# EAGLE design mainboard (EAGLE 7.6.0)
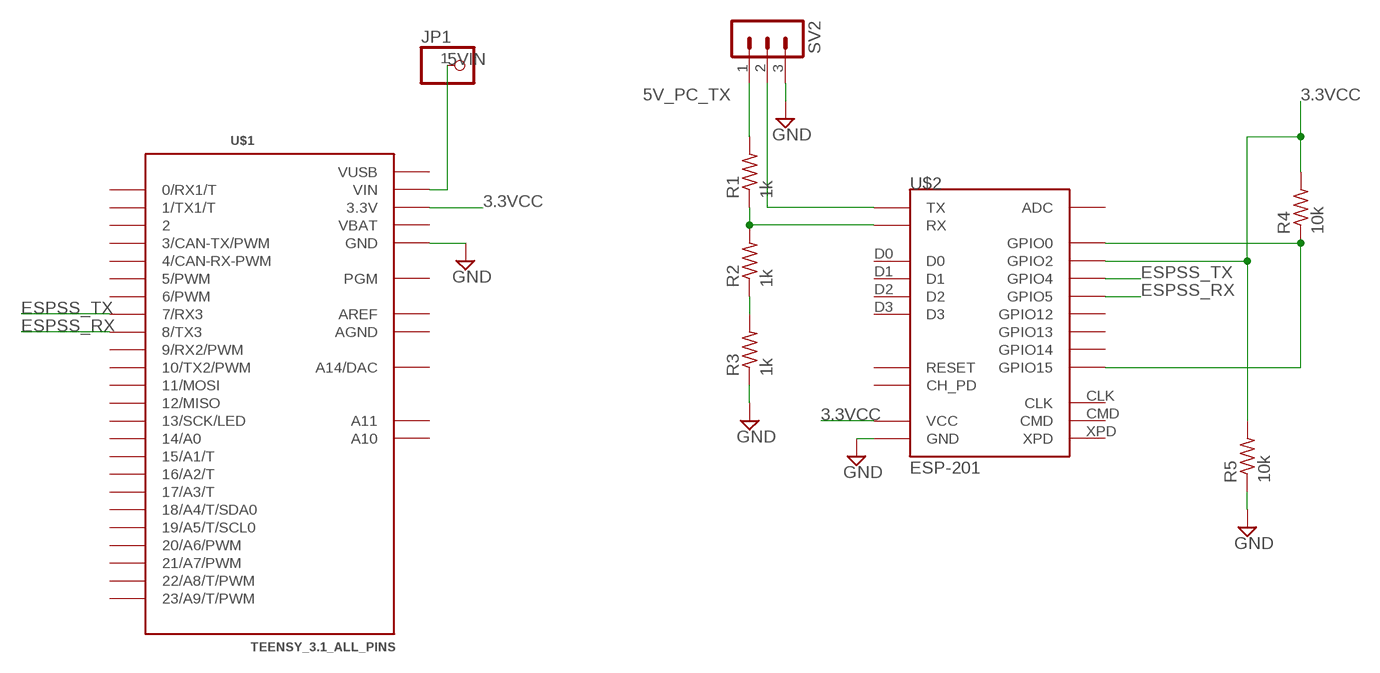
[diagram p0: schematic, sheet 1]

## Parts
JP1  PINHD-1X1  [1X01]
R1  1k  R-US_0207/7  [0207/7]
R2  1k  R-US_0207/7  [0207/7]
R3  1k  R-US_0207/7  [0207/7]
R4  10k  R-US_0207/7  [0207/7]
R5  10k  R-US_0207/7  [0207/7]
SV2  MA03-1  [MA03-1]
U$1  TEENSY_3.1_ALL_PINS  [TEENSY3-ALL_PINS]
U$2  ESP-201  [ESP-201]

## Nets
3.3VCC: R4.2 R5.2 U$1.3.3V U$1.3.3V1(3.3V) U$2.3V3(VCC) U$2.3V3_2(VCC) U$2.3V3_3(VCC) U$2.GPIO2
5V_PC_TX: R1.2 SV2.1
5VIN: JP1.1 U$1.VIN
ESPSS_RX: U$1.8(8/TX3) U$2.GPIO5
ESPSS_TX: U$1.7(7/RX3) U$2.GPIO4
GND: R3.1 R5.1 SV2.3 U$1.GND U$1.GND1(GND) U$2.GND U$2.GND_2(GND) U$2.GND_3(GND)
N$1: R1.1 R2.2 U$2.RX
N$4: SV2.2 U$2.TX
N$6: R4.1 U$2.GPIO0 U$2.GPIO15
N$8: R2.1 R3.2
Unconnected: U$1.0(0/RX1/T) U$1.1(1/TX1/T) U$1.2 U$1.3(3/CAN-TX/PWM) U$1.4(4/CAN-RX-PWM) U$1.5(5/PWM) U$1.6(6/PWM) U$1.9(9/RX2/PWM) U$1.10(10/TX2/PWM) U$1.11(11/MOSI) U$1.12(12/MISO) U$1.13(13/SCK/LED) U$1.14/A0 U$1.15/A1(15/A1/T) U$1.16/A2(16/A2/T) U$1.17/A3(17/A3/T) U$1.18/A4(18/A4/T/SDA0) U$1.19/A5(19/A5/T/SCL0) U$1.20/A6(20/A6/PWM) U$1.21/A7(21/A7/PWM) U$1.22/A8(22/A8/T/PWM) U$1.23/A9(23/A9/T/PWM) U$1.A10 U$1.A11 U$1.PGM U$1.RESET/DAC(A14/DAC) U$2.ADC U$2.CH_PD U$2.CLK U$2.CMD U$2.D0 U$2.D1 U$2.D2 U$2.D3 U$2.GPIO12 U$2.GPIO13 U$2.GPIO14 U$2.RST(RESET) U$2.XPD

## Power pins joined to a net without a drawn wire
AGND: U$1.AGND
AREF: U$1.AREF
VBAT: U$1.VBAT
VUSB: U$1.VUSB

## Library data of the parts
JP1 = pinhead:PINHD-1X1: PIN HEADER
R1-R5 = resistor:R-US_: RESISTOR, American symbol
SV2 = con-lstb:MA03-1: PIN HEADER; OC_FARNELL: unknown; OC_NEWARK: unknown
U$1 = Teensy_3_and_LC_Series_Boards_v1.1:TEENSY_3.1_ALL_PINS: Footprint for Teensy 3.1 or 3.2 board using all through-holes, i.e. the entire perimeter plus the 4 through-holes inboard (A10,A11,AREF, VUSB)
U$2 = esp8266modules:ESP-201: ESP8266 Wifi Module ESP-201; DIMENSIONS: 25 x 35 mm; PINS: 26; PITCH: 0.1" / 2.54 mm

## Board
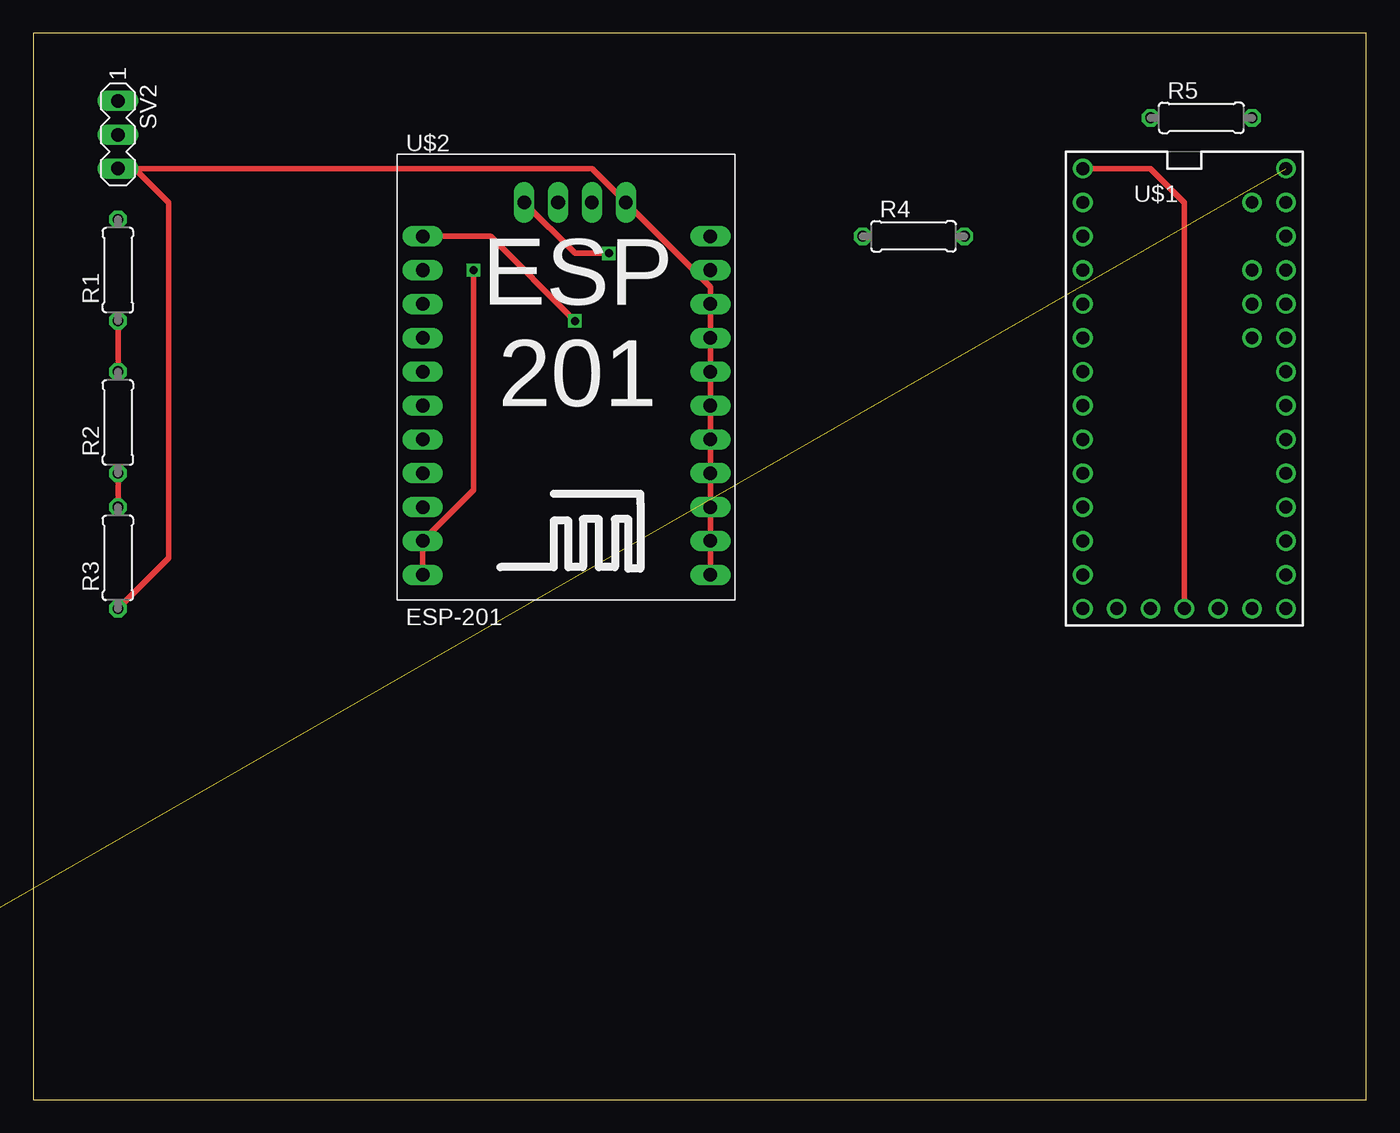
[diagram p1: board, top side]
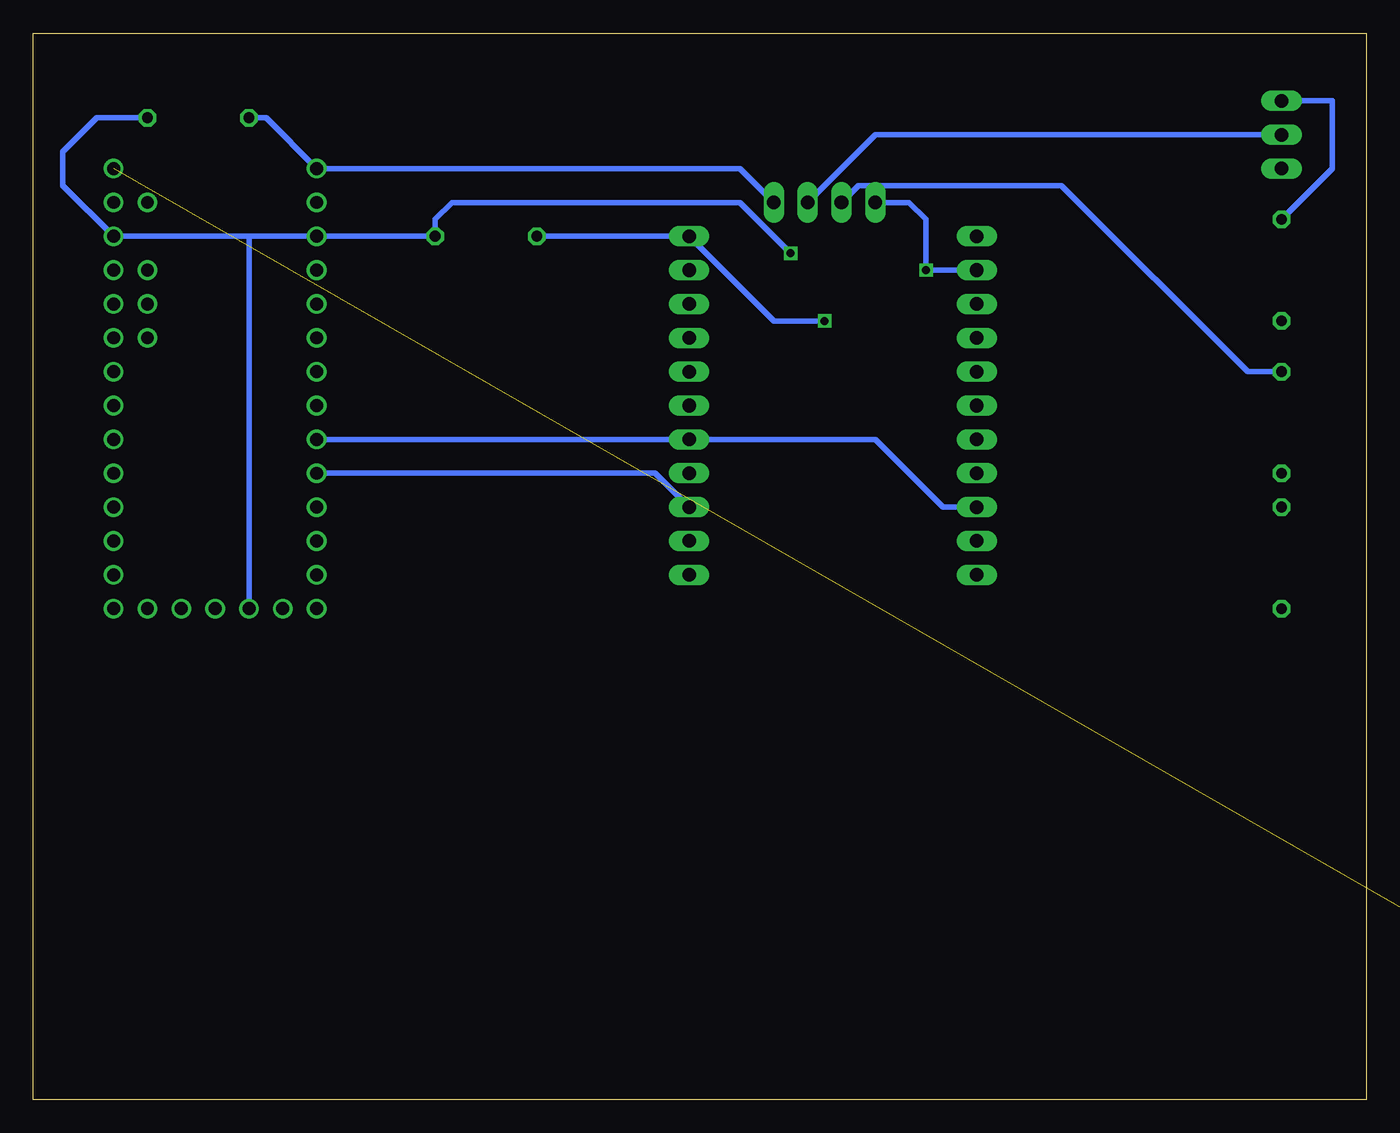
[diagram p2: board, bottom side, seen from below]

Size 100 x 80 mm. Coordinates in mm from the lower left corner, seen from the top.
Outline: 0,0 100,0 100,80 0,80 0,0
Copper layers (1*16): Top 0.035mm / dielectric 1.5mm / Bottom 0.035mm
Design rules "default": minimum track width 10mil, minimum drill 24mil, track to track 8mil, track to pad 8mil, pad to pad 8mil, via to via 8mil, smd to smd 8mil, copper to edge 40mil, drill to drill 8mil, minimum pad ring 10mil, minimum via ring 8mil, stop-mask expansion 4mil, vias tented up to drill 0mil, thermal gap 10mil

### Footprints (pad centres in the part's own frame; a part is rotated, then mirrored left to right if it is on the bottom)
1X01 = drill 1.016 octagon: 1 0,0
0207/7 = drill 0.813 octagon: 1 -3.81,0; 2 3.81,0
MA03-1 = drill 1.016 long: 1 -2.54,0; 2 0,0; 3 2.54,0
TEENSY3-ALL_PINS = drill 0.965: 0 -7.62,13.97; 1 -7.62,11.43; 2 -7.62,8.89; 3 -7.62,6.35; 3.3V 7.62,11.43; 3.3V1 -2.54,-16.51; 4 -7.62,3.81; 5 -7.62,1.27; 6 -7.62,-1.27; 7 -7.62,-3.81; 8 -7.62,-6.35; 9 -7.62,-8.89; 10 -7.62,-11.43; 11 -7.62,-13.97; 12 -7.62,-16.51; 13 7.62,-16.51; 14/A0 7.62,-13.97; 15/A1 7.62,-11.43; 16/A2 7.62,-8.89; 17/A3 7.62,-6.35; 18/A4 7.62,-3.81; 19/A5 7.62,-1.27; 20/A6 7.62,1.27; 21/A7 7.62,3.81; 22/A8 7.62,6.35; 23/A9 7.62,8.89; A10 5.08,6.35; A11 5.08,3.81; AGND 7.62,13.97; AREF 5.08,8.89; GND -7.62,16.51; GND1 0,-16.51; PGM 2.54,-16.51; RESET/DAC 5.08,-16.51; VBAT -5.08,-16.51; VIN 7.62,16.51; VUSB 5.08,13.97
ESP-201 = drill 1.016 long: 3V3 0,2.54; 3V3_2 0,0; 3V3_3 7.62,27.94; ADC 21.59,7.62; CH_PD 21.59,12.7; CLK 0,17.78; CMD 0,15.24; D0 0,12.7; D1 0,10.16; D2 0,20.32; D3 0,7.62; GND 21.59,2.54; GND_2 21.59,0; GND_3 15.24,27.94; GPIO0 0,25.4; GPIO2 0,22.86; GPIO4 0,5.08; GPIO5 21.59,5.08; GPIO12 21.59,20.32; GPIO13 21.59,22.86; GPIO14 21.59,17.78; GPIO15 21.59,25.4; RST 21.59,10.16; RX 10.16,27.94; TX 12.7,27.94; XPD 21.59,15.24

### Placement (x,y rotation side)
JP1  -34.29,-3.81 0 top  (outside the outline)
R1  6.35,62.23 90 top
R2  6.35,50.8 90 top
R3  6.35,40.64 90 top
R4  66.04,64.77 0 top
R5  87.63,73.66 0 top
SV2  6.35,72.39 270 top
U$1  86.36,53.34 0 top
U$2  29.21,39.37 0 top

### Tracks (layer width: path | path; a pad name or v marks a point on that pad's centre or on a via)
3.3VCC  (via drill 0.6)
  Top 0.406: v43.18,63.5 40.64,63.5 U$2.3V3_3 | v33.02,62.23 33.02,45.72 U$2.3V3 U$2.3V3_2
  Bottom 0.406: 83.82,64.77 R4.2 69.85,66.04 68.58,67.31 46.99,67.31 v43.18,63.5 | 83.82,64.77 U$1.3.3V 97.79,68.58 97.79,71.12 95.25,73.66 R5.2 | U$1.3.3V1 83.82,64.77 | U$2.3V3_3 34.29,67.31 33.02,66.04 v33.02,62.23 U$2.GPIO2
5V_PC_TX
  Bottom 0.406: R1.2 2.54,69.85 2.54,74.93 SV2.1
5VIN  (1 unrouted)
ESPSS_RX
  Bottom 0.406: U$1.8 53.34,46.99 U$2.GPIO5
ESPSS_TX
  Bottom 0.406: U$2.GPIO4 31.75,44.45 36.83,49.53 U$1.7
GND
  Top 0.406: R3.1 10.16,40.64 10.16,67.31 7.62,69.85 SV2.3 41.91,69.85 U$2.GND_3 50.8,60.96 U$2.GND U$2.GND_2 | U$1.GND 83.82,69.85 86.36,67.31 U$1.GND1
  Bottom 0.406: R5.1 82.55,73.66 U$1.GND 46.99,69.85 U$2.GND_3
N$1
  Top 0.406: R1.1 R2.2
  Bottom 0.406: R2.2 8.89,54.61 22.86,68.58 38.1,68.58 U$2.RX
N$4
  Bottom 0.406: SV2.2 36.83,72.39 U$2.TX
N$6  (via drill 0.6)
  Top 0.406: U$2.GPIO0 34.29,64.77 v40.64,58.42
  Bottom 0.406: R4.1 U$2.GPIO15 44.45,58.42 v40.64,58.42
N$8
  Top 0.406: R3.2 R2.1